# EAGLE design LoRa_Photon2 (EAGLE 9.6.2)

## Sheet 1 of 2

## Sheet 2 of 2
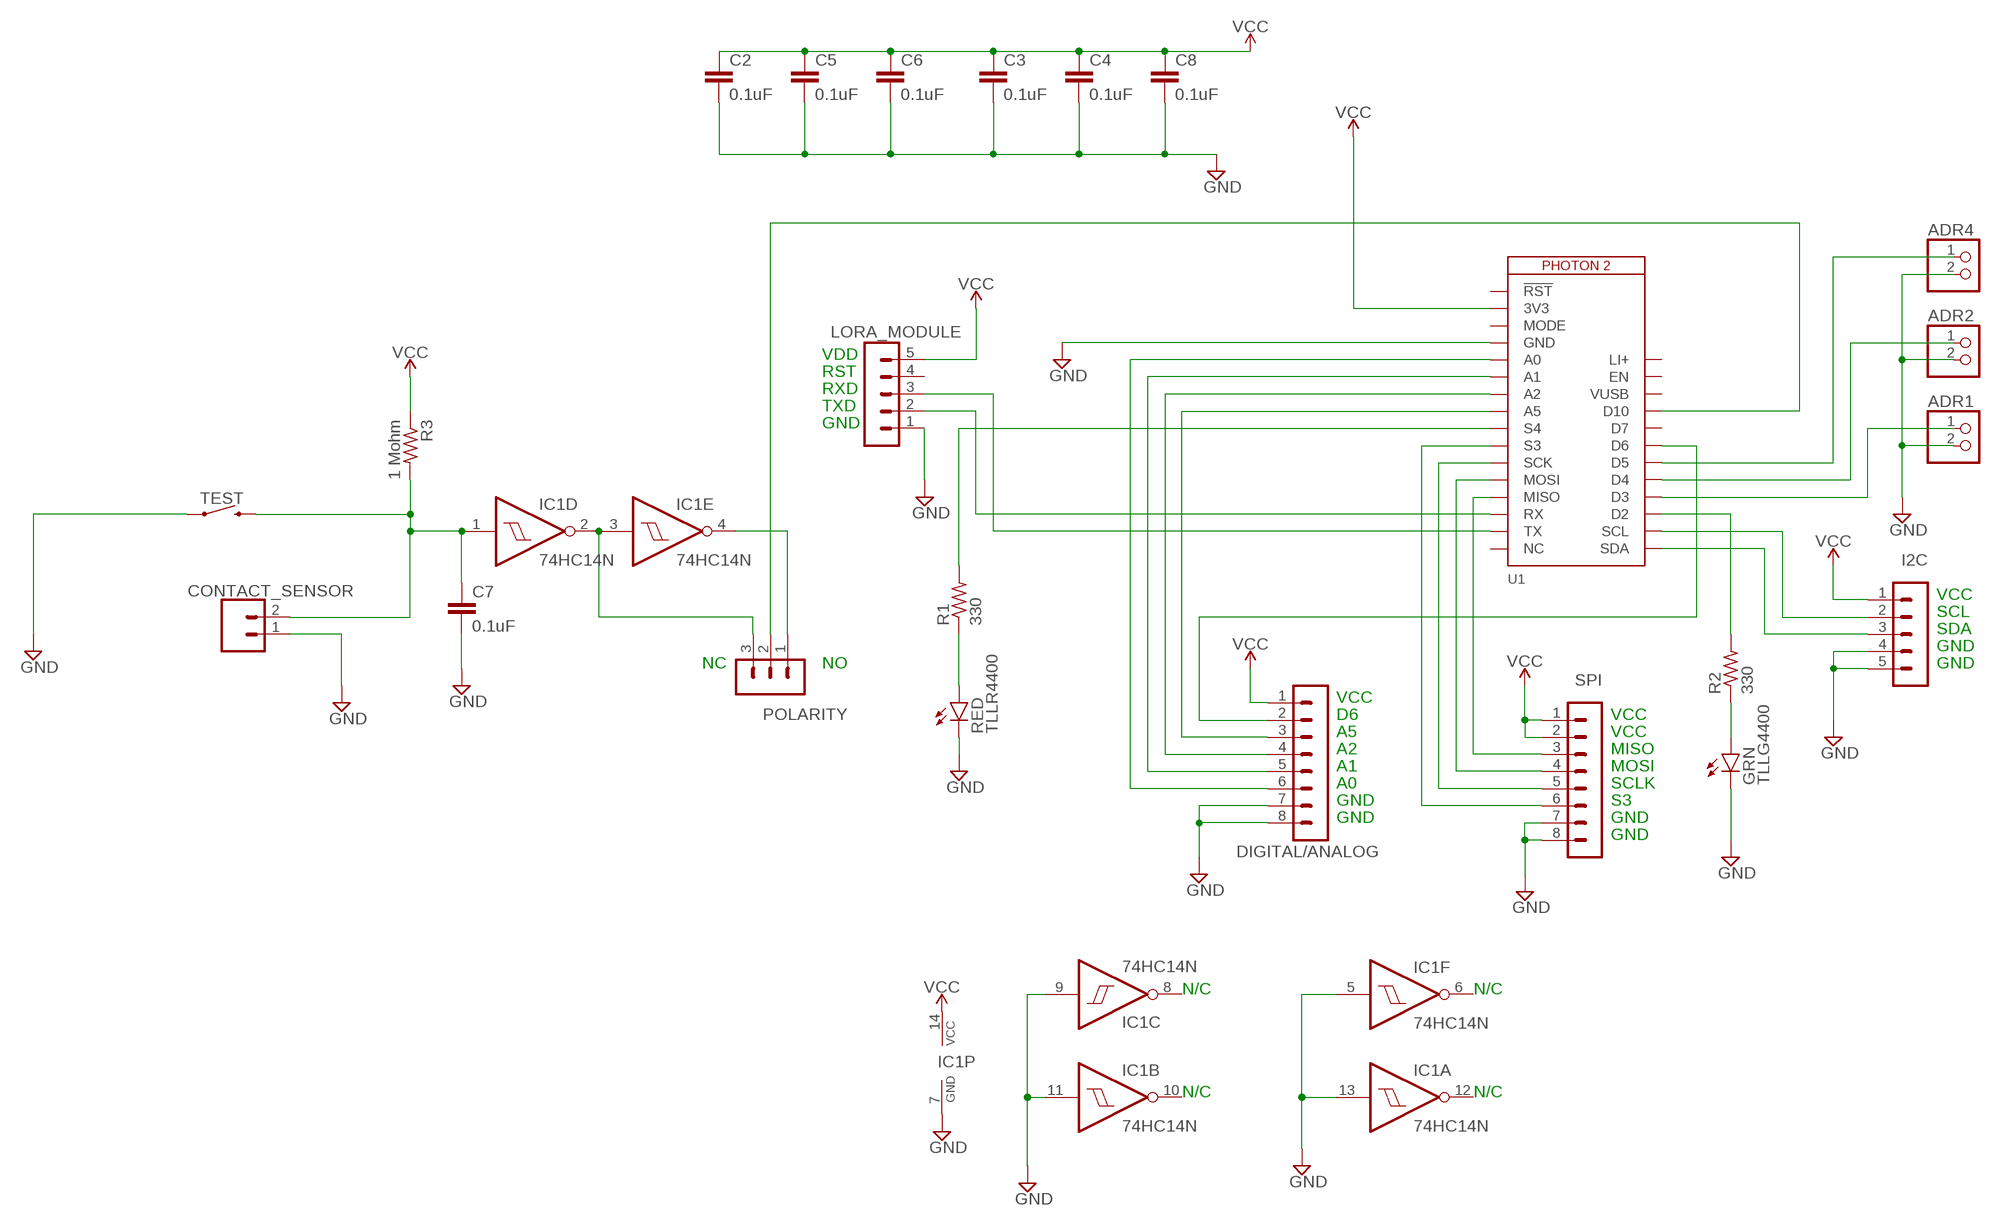
[diagram p0: schematic, sheet 2]

### Parts
ADR1  PINHD-1X2  [1X02]
ADR2  PINHD-1X2  [1X02]
ADR4  PINHD-1X2  [1X02]
C2  0.1uF  0.1UF-KIT-EZ-50V-20%  [CAP-PTH-SMALL-KIT]
C3  0.1uF  0.1UF-KIT-EZ-50V-20%  [CAP-PTH-SMALL-KIT]
C4  0.1uF  0.1UF-KIT-EZ-50V-20%  [CAP-PTH-SMALL-KIT]
C5  0.1uF  0.1UF-KIT-EZ-50V-20%  [CAP-PTH-SMALL-KIT]
C6  0.1uF  0.1UF-KIT-EZ-50V-20%  [CAP-PTH-SMALL-KIT]
C7  0.1uF  0.1UF-KIT-EZ-50V-20%  [CAP-PTH-SMALL-KIT]
C8  0.1uF  0.1UF-KIT-EZ-50V-20%  [CAP-PTH-SMALL-KIT]
CONTACT_SENSOR  CONN_023.5MM  [SCREWTERMINAL-3.5MM-2]
DIGITAL/ANALOG  MA08-1  [MA08-1]
GRN  TLLG4400  [LED3MM]
I2C  MA05-1  [MA05-1]
IC1  74HC14N  [DIL14]
LORA_MODULE  MA05-1  [MA05-1]
POLARITY  MA03-1  [MA03-1]
R1  330  R-US_0309/12  [0309/12]
R2  330  R-US_0309/12  [0309/12]
R3  1 Mohm  R-US_0309/12  [0309/12]
RED  TLLR4400  [LED3MM]
SPI  MA08-1  [MA08-1]
TEST  MOMENTARY-SWITCH-SPST-PTH-6.0MM  [TACTILE_SWITCH_PTH_6.0MM]
U1  PHOTON2  [PHOTON2]

### Nets
GND: ADR1.2 ADR2.2 ADR4.2 C2.2 C3.2 C4.2 C5.2 C6.2 C7.2 C8.2 CONTACT_SENSOR.1 DIGITAL/ANALOG.7 DIGITAL/ANALOG.8 GRN.K(C) I2C.4 I2C.5 IC1.5(F:I) IC1.7(P:GND) IC1.9(C:I) IC1.11(B:I) IC1.13(A:I) LORA_MODULE.1 RED.K(C) SPI.7 SPI.8 TEST.1 U1.4(GND)
N$1: C7.1 CONTACT_SENSOR.2 IC1.1(D:I) R3.2 TEST.3
N$2: LORA_MODULE.3 U1.15(TX)
N$3: GRN.A R2.1
N$4: R2.2 U1.19(D2)
N$5: R1.2 U1.9(S4)
N$6: R1.1 RED.A
N$7: ADR4.1 U1.22(D5)
N$8: IC1.2(D:O) IC1.3(E:I) POLARITY.3
N$9: IC1.4(E:O) POLARITY.1
N$10: I2C.2 U1.18(SCL)
N$11: ADR2.1 U1.21(D4)
N$12: LORA_MODULE.2 U1.14(RX)
N$13: I2C.3 U1.17(SDA)
N$14: POLARITY.2 U1.25(D10)
N$15: ADR1.1 U1.20(D3)
N$16: SPI.3 U1.13(MISO)
N$17: SPI.4 U1.12(MOSI)
N$18: SPI.5 U1.11(SCK)
N$19: SPI.6 U1.10(S3)
N$20: DIGITAL/ANALOG.2 U1.23(D6)
N$21: DIGITAL/ANALOG.3 U1.8(A5)
N$22: DIGITAL/ANALOG.4 U1.7(A2)
N$23: DIGITAL/ANALOG.5 U1.6(A1)
N$24: DIGITAL/ANALOG.6 U1.5(A0)
VCC: C2.1 C3.1 C4.1 C5.1 C6.1 C8.1 DIGITAL/ANALOG.1 I2C.1 IC1.14(P:VCC) LORA_MODULE.5 R3.1 SPI.1 SPI.2 U1.2(3V3)
Unconnected: IC1.6(F:O) IC1.8(C:O) IC1.10(B:O) IC1.12(A:O) LORA_MODULE.4 U1.1(!RST) U1.3(MODE) U1.16(NC) U1.24(D7) U1.27(EN)

### Notes on the sheet
- VDD
- RST
- RXD
- TXD
- GND
- VCC
- SCL
- SDA
- GND
- NC | NO | GND
- VCC
- D6 | VCC
- A5 | VCC
- A2 | MISO
- A1 | MOSI
- A0 | SCLK
- GND | S3
- GND | GND
- GND
- N/C | N/C
- N/C | N/C

## Power pins joined to a net without a drawn wire
LI+: U1.28(LI+)
VUSB: U1.26(VUSB)

## Library data of the parts
ADR1 ADR2 ADR4 = pinhead:PINHD-1X2: PIN HEADER
C2-C8 = SparkFun-Capacitors:0.1UF: 0.1µF ceramic capacitors A capacitor is a passive two-terminal electrical component used to store electrical energy temporarily in an electric field.; PROD_ID: CAP-08370
CONTACT_SENSOR = SparkFun-Connectors:CONN_02: Multi connection point. Often used as Generic Header-pin footprint for 0.1 inch spaced/style header connections On any of the 0.1 inch spaced packages, you can populate with these: Break Away Headers - Straight <https://www.sparkfun.com/products/116> (PRT-00116) Break Away Male Headers - Right Angle <https://www.sparkfun.com/products/553> (PRT-00553) Female Headers <https://www.sparkfun.com/products/115> (PRT-00115) Break Away Headers - Machine Pin <https://www.sparkfun.com/products/117> (PRT-00117) Break Away Female Headers - Swiss Machine Pin <https://www.sparkfun.com/products/743> (PRT-00743) For SCREWTERMINALS and SPRING TERMINALS visit here: Screw Terimnals on SparkFun.com <https://www.sparkfun.com/search/results?term=Screw+Terminals> (5mm/3.5mm/2.54mm spacing) This device is also useful as a general connection point to wire up your design to another part of your project. Our various solder wires solder well into these plated through hole pads. Hook-Up Wire - Assortment (Stranded, 22 AWG) <https://www.sparkfun.com/products/11375> (PRT-11375) Hook-Up Wire - Assortment (Solid Core, 22 AWG) <https://www.sparkfun.com/products/11367> (PRT-11367) View the entire wire category on our website here <https://www.sparkfun.com/categories/141> Special notes: Molex polarized connector foot print use with: PRT-08233 with associated crimp pins and housings. 2.54_SCREWTERM for use with PRT-10571. 3.5mm Screw Terminal footprints for PRT-08084 5mm Screw Terminal footprints for use with PRT-08432; PROD_ID: CONN-08399
DIGITAL/ANALOG SPI = con-lstb:MA08-1: PIN HEADER; OC_FARNELL: unknown; OC_NEWARK: unknown
GRN = led:TLLG4400: Low Current (2mA) LED 3 mm Tinted Diffused Package color GREEN Source: Data sheet <http://www.farnell.com/datasheets/391098.pdf>; MF: VISHAY SEMICONDUCTOR; OC_FARNELL: 1612435
I2C LORA_MODULE = con-lstb:MA05-1: PIN HEADER; OC_FARNELL: unknown; OC_NEWARK: unknown
IC1 = 74xx-eu:74*14: Hex schmitt trigger INVERTER
POLARITY = con-lstb:MA03-1: PIN HEADER; OC_FARNELL: unknown; OC_NEWARK: unknown
R1-R3 = adafruit:R-US_: RESISTOR, American symbol
RED = led:TLLR4400: Low Current (2mA) LED 3 mm Tinted Diffused Package color RED Source: Data sheet <http://www.farnell.com/datasheets/391100.pdf>; MF: VISHAY SEMICONDUCTOR; OC_FARNELL: 1612437
TEST = SparkFun-Switches:MOMENTARY-SWITCH-SPST: Momentary Switch (Pushbutton) - SPST Normally-open (NO) SPST momentary switches (buttons, pushbuttons). Variants PTH-12MM - 12mm square, through-hole Momentary Pushbutton Switch - 12mm Square <https://www.sparkfun.com/products/9190> (COM-09190) PTH-6.0MM, PTH-6.0MM-KIT - 6.0mm square, through-hole Mini Pushbutton Switch <https://www.sparkfun.com/products/97> (COM-00097) KIT package intended for soldering kit's - only one side of pads' copper is exposed. PTH-RIGHT-ANGLE-KIT - Right-angle, through-hole Right Angle Tactile Button <https://www.sparkfun.com/products/10791> - Used on SparkFun BigTime Watch Kit <https://www.sparkfun.com/products/11734> SMD-12MM - 12mm square, surface-mount Tactile Button - SMD (12mm) <https://www.sparkfun.com/products/12993> (COM-12993) Used on SparkFun PicoBoard <https://www.sparkfun.com/products/11888> SMD-4.5MM - 4.5mm Square Trackball Switch Used on SparkFun Blackberry Trackballer Breakout <https://www.sparkfun.com/products/13169> SMD-4.6MMX2.8MM - 4.60mm x 2.80mm, surface mount Used on SparkFun SAMD21 Mini Breakout <https://www.sparkfun.com/products/13664> SMD-5.2MM, SMD-5.2-REDUNDANT - 5.2mm square, surface-mount Mini Pushbutton Switch - SMD <https://www.sparkfun.com/products/8720> (COM-08720) Used on Arduino Pro Mini <https://www.sparkfun.com/products/11114> REDUNDANT package connects both switch circuits together SMD-6.0X3.5MM - 6.0 x 3.5mm, surface mount Momentary Reset Switch SMD <https://www.sparkfun.com/products/8229> (COM-08229) SMD-6.2MM-TALL - 6.2mm square, surface mount Tactile Button - SMD (6mm) <https://www.sparkfun.com/products/12992> Used on SparkFun Digital Sandbox <https://www.sparkfun.com/products/12651> SMD-RIGHT-ANGLE - Right-angle, surface mount Used on SparkFun Block for Intel® Edison - Arduino <https://www.sparkfun.com/products/13036>; PROD_ID: SWCH-08441; SF_SKU: COM-00097
U1 = Particle-Devices:PHOTON2: Particle Photon 2 Wi-Fi enabled development kit Footprint and formfactor based on Adafruit Feather. <https://www.adafruit.com/feather>

## Board
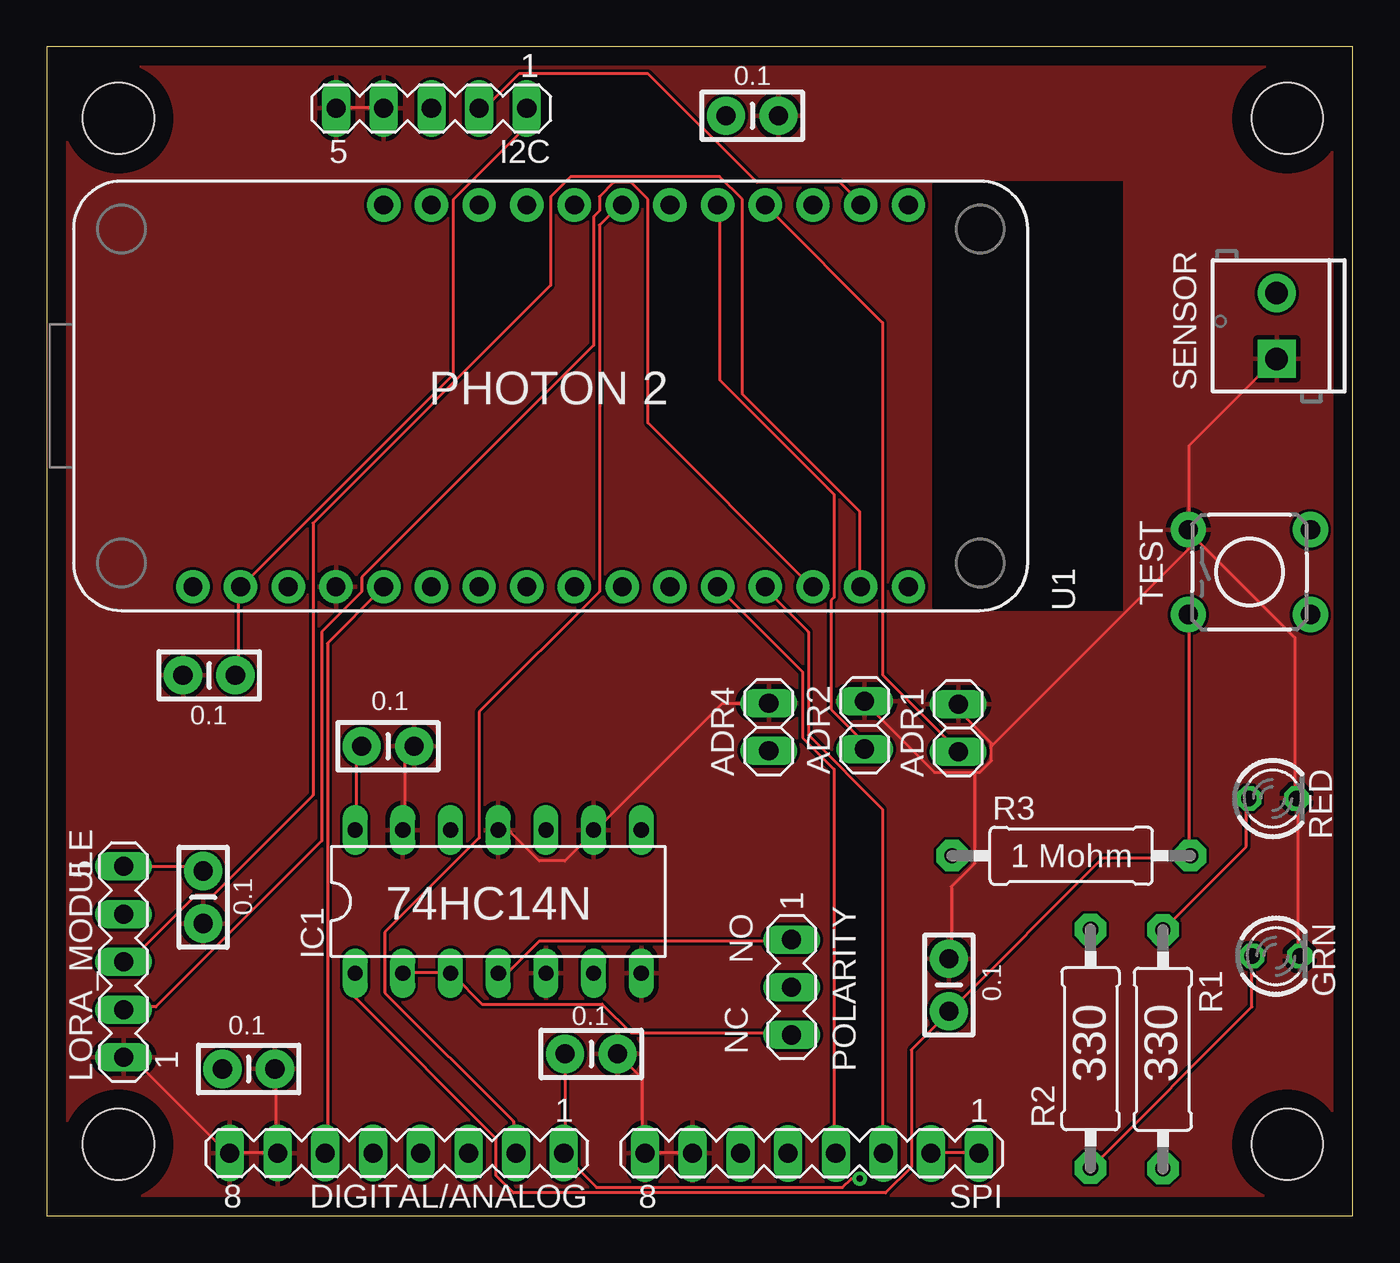
[diagram p1: board, top side]
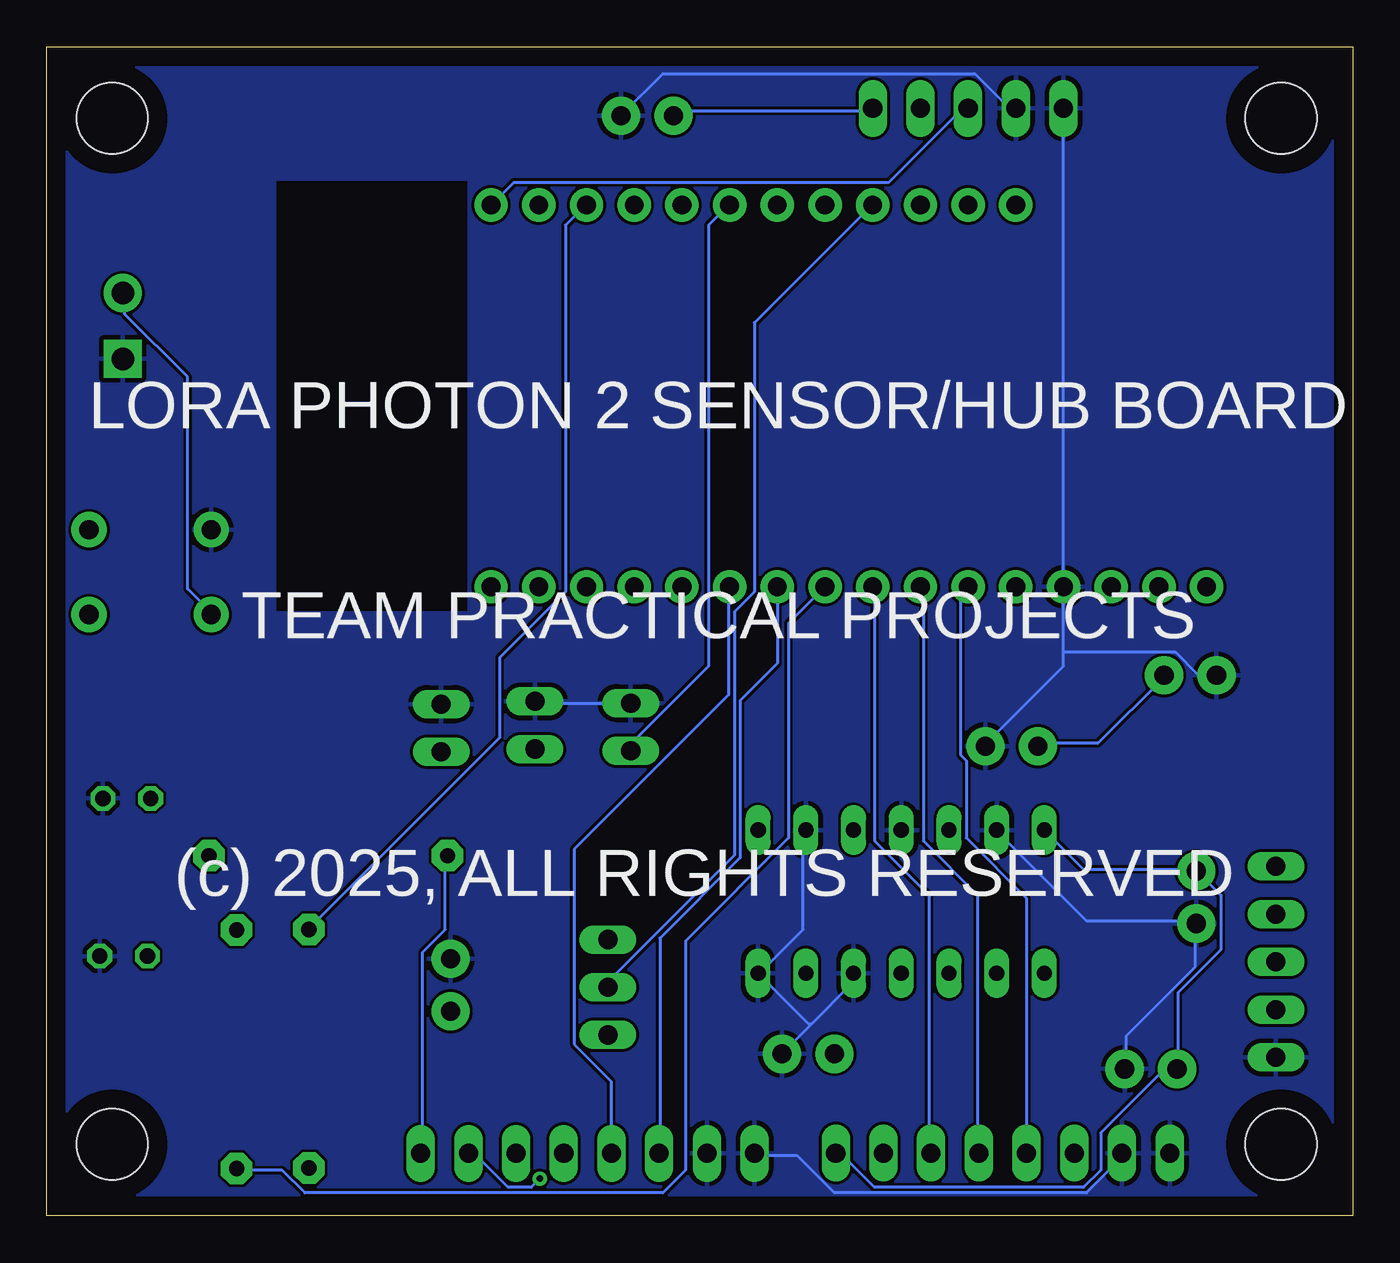
[diagram p2: board, bottom side, seen from below]

Size 69.52 x 62.22 mm. Coordinates in mm from the lower left corner, seen from the top.
Outline: 0,0 69.52,0 69.52,62.22 0,62.22 0,0
Copper layers (1*16): Top 0.035mm / dielectric 1.5mm / Bottom 0.035mm
Design rules "default": minimum track width 6mil, minimum drill 0.35mm, track to track 6mil, track to pad 6mil, pad to pad 6mil, via to via 6mil, smd to smd 6mil, copper to edge 40mil, drill to drill 6mil, minimum pad ring 10mil, minimum via ring 8mil, stop-mask expansion 4mil, vias tented up to drill 0mil, thermal gap 10mil
Holes 3.8 mm at 3.81,58.42 66.04,58.42 66.04,3.81 3.81,3.81
tKeepout: area 47,31.8 to 57.1,55.9
bKeepout: area 47,31.8 to 57.1,55.9

### Footprints (pad centres in the part's own frame; a part is rotated, then mirrored left to right if it is on the bottom)
1X02 = drill 1.016 long: 1 -1.27,0; 2 1.27,0
CAP-PTH-SMALL-KIT = drill 1.016 pad 2.032: 1 -1.397,0; 2 1.397,0
SCREWTERMINAL-3.5MM-2 = drill 1.2 pad 2.032 square: 1 0,0 | drill 1.2 pad 2.032: 2 3.5,0
MA08-1 = drill 1.016 long: 1 -8.89,0; 2 -6.35,0; 3 -3.81,0; 4 -1.27,0; 5 1.27,0; 6 3.81,0; 7 6.35,0; 8 8.89,0
LED3MM = drill 0.813 octagon: A -1.27,0; K 1.27,0
MA05-1 = drill 1.016 long: 1 -5.08,0; 2 -2.54,0; 3 0,0; 4 2.54,0; 5 5.08,0
DIL14 = drill 0.813 long: 1 -7.62,-3.81; 2 -5.08,-3.81; 3 -2.54,-3.81; 4 0,-3.81; 5 2.54,-3.81; 6 5.08,-3.81; 7 7.62,-3.81; 8 7.62,3.81; 9 5.08,3.81; 10 2.54,3.81; 11 0,3.81; 12 -2.54,3.81; 13 -5.08,3.81; 14 -7.62,3.81
MA03-1 = drill 1.016 long: 1 -2.54,0; 2 0,0; 3 2.54,0
0309/12 = drill 0.813 pad 1.676 octagon: 1 -6.35,0; 2 6.35,0
TACTILE_SWITCH_PTH_6.0MM = drill 1.016 pad 1.88: 1 -3.251,2.261; 2 3.251,2.261; 3 -3.251,-2.261; 4 3.251,-2.261
PHOTON2 = drill 1 pad 1.778: 1 1.27,44.45; 2 1.27,41.91; 3 1.27,39.37; 4 1.27,36.83; 5 1.27,34.29; 6 1.27,31.75; 7 1.27,29.21; 8 1.27,26.67; 9 1.27,24.13; 10 1.27,21.59; 11 1.27,19.05; 12 1.27,16.51; 13 1.27,13.97; 14 1.27,11.43; 15 1.27,8.89; 16 1.27,6.35; 17 21.59,6.35; 18 21.59,8.89; 19 21.59,11.43; 20 21.59,13.97; 21 21.59,16.51; 22 21.59,19.05; 23 21.59,21.59; 24 21.59,24.13; 25 21.59,26.67; 26 21.59,29.21; 27 21.59,31.75; 28 21.59,34.29

### Placement (x,y rotation side)
ADR1  48.52,25.97 90 top
ADR2  43.54,26.12 90 top
ADR4  38.43,26.02 90 top
C2  8.32,16.96 270 top
C3  18.16,25 0 top
C4  8.64,28.77 180 top
C5  10.74,7.82 0 top
C6  28.99,8.62 0 top
C7  48.03,12.29 90 top
C8  37.56,58.56 0 top
CONTACT_SENSOR  65.48,45.62 90 top
DIGITAL/ANALOG  18.63,3.34 180 top
GRN  65.44,13.83 0 top
I2C  20.47,58.95 180 top
IC1  24.03,16.73 0 top
LORA_MODULE  4.08,13.52 90 top
POLARITY  39.65,12.17 270 top
R1  59.42,8.87 270 top
R2  55.57,8.9 90 top
R3  54.54,19.17 0 top
RED  65.27,22.22 0 top
SPI  40.73,3.33 180 top
TEST  64.03,34.27 0 top
U1  52.22,32.22 90 top

### Tracks (layer width: path | path; a pad name or v marks a point on that pad's centre or on a via)
GND
  Top 0.152: GRN.K 66.6,13.87 66.6,22.1 RED.K 66.45,22.25 66.45,30.79 61.27,35.97 | TEST.1 60.81,36.58 60.81,41 65.38,45.57 CONTACT_SENSOR.1 | 61.27,35.97 60.81,36.42 TEST.1 | 50.29,24.99 50.29,24.23 49.68,23.62 49.38,23.62 | 50.29,24.99 50.29,25.15 48.62,26.82 48.62,27.13 ADR1.2 | 49.38,23.62 47.24,23.62 43.59,27.28 ADR2.2 | 49.38,23.62 49.38,18.75 48.16,17.53 48.16,13.72 C7.2 | IC1.11 24.08,20.42 24.69,20.42 26.21,18.9 27.58,18.9 29.11,20.42 IC1.9 29.26,20.57 35.97,27.28 38.41,27.28 ADR4.2 | SPI.7 34.29,3.35 31.85,3.35 SPI.8 31.7,3.35 31.7,7.32 30.48,8.53 C6.2 | 50.29,24.99 61.27,35.97 | 61.27,35.97 TEST.1 | I2C.5 15.39,58.98 17.83,58.98 I2C.4 | 12.19,3.35 9.75,3.35 DIGITAL/ANALOG.8 9.6,3.35 4.57,8.38 4.12,8.38 LORA_MODULE.1 | 12.19,3.35 12.19,7.77 C5.2 | 12.19,3.35 DIGITAL/ANALOG.7 | IC1.13 19.05,20.57 19.05,24.54 19.51,24.99 C3.2
  Bottom 0.152: ADR4.2 38.56,27.28 43.43,27.28 ADR2.2 | 28.8,10.21 30.33,8.69 C6.2 | 28.8,10.21 26.67,12.34 26.67,12.8 IC1.5 | 28.8,10.21 28.96,10.21 31.55,12.8 IC1.7 31.55,12.95 29.26,15.24 29.26,20.42 IC1.9 | I2C.4 17.98,58.98 18.29,58.98 20.12,60.81 36.73,60.81 38.86,58.67 C8.2 | C5.2 12.04,7.92 12.04,9.6 8.38,13.26 8.38,15.54 C2.2 8.38,15.7 14.17,15.7 18.9,20.42 IC1.13 | 15.39,30.02 15.39,29.26 19.51,25.15 C3.2 | 15.39,30.02 15.39,33.38 U1.4 15.39,33.53 15.39,58.83 I2C.5 | 15.39,30.02 9.45,30.02 8.23,28.8 7.32,28.8 C4.2 | SPI.8 31.7,3.2 29.57,3.2 27.58,1.22 14.17,1.22 12.19,3.2 DIGITAL/ANALOG.7
  pour Top: 0,0 69.85,0 69.85,62.23 0,62.23
  pour Bottom: 0,0 69.85,0 69.85,62.23 0,62.23
N$1
  Top 0.152: TEST.3 60.81,32 60.81,19.2 R3.2 60.81,19.05 56.24,19.05 48.16,10.97 C7.1 48.01,10.82 46.02,8.84 46.02,2.59 44.65,1.22 24.84,1.22 23.93,2.13 23.93,4.12 16.46,11.58 16.46,12.8 IC1.1
  Bottom 0.152: CONTACT_SENSOR.2 65.38,49.07 65.38,48.01 62.03,44.65 62.03,33.38 60.81,32.16 TEST.3
N$2
  Top 0.152: LORA_MODULE.3 4.12,13.56 4.42,13.56 7.92,17.07 8.84,17.07 14.17,22.4 14.17,36.88 26.82,49.53 26.82,54.25 27.89,55.32 35.81,55.32 37.03,54.1 37.03,43.74 43.28,37.49 43.28,33.53 U1.15
N$3
  Top 0.152: GRN.A 64.16,13.72 64.16,11.12 55.63,2.59 R2.1
N$4
  Bottom 0.152: R2.2 55.47,15.39 45.41,25.45 45.41,29.72 41.91,33.22 41.91,52.73 40.84,53.8 U1.19
N$5
  Bottom 0.152: R1.2 59.28,2.44 57,2.44 55.78,1.22 36.73,1.22 35.51,2.44 35.51,14.63 30.02,20.12 30.02,31.55 28.19,33.38 U1.9
N$6
  Top 0.152: RED.A 63.86,22.1 63.86,19.66 59.44,15.24 R1.1
N$7
  Bottom 0.152: ADR4.1 38.41,24.84 38.41,25.15 34.29,29.26 34.29,52.73 33.22,53.8 U1.22
N$8
  Top 0.152: IC1.2 19.05,12.95 21.49,12.95 IC1.3 21.64,12.8 23.16,11.28 29.57,11.28 31.09,9.75 39.62,9.75 POLARITY.3
N$9
  Top 0.152: IC1.4 24.08,12.95 24.54,12.95 26.21,14.63 39.62,14.63 POLARITY.1
N$10
  Top 0.152: I2C.2 23.01,58.98 23.32,58.98 25.15,60.81 32,60.81 37.8,55.02 42.22,55.02 43.28,53.95 U1.18
N$11
  Top 0.152: ADR2.1 43.43,24.99 43.43,25.3 41.76,26.98 41.76,32.77 41.91,32.92 41.91,38.41 35.81,44.5 35.81,53.8 U1.21
N$12
  Top 0.152: LORA_MODULE.2 4.12,11.12 5.79,11.12 14.63,19.96 14.63,31.09 16.76,33.22 16.76,33.98 29.11,46.33 29.11,53.19 29.41,53.49 29.41,54.25 30.18,55.02 31.09,55.02 32,54.1 32,42.22 40.69,33.53 U1.14
N$13
  Bottom 0.152: I2C.3 20.57,58.83 20.88,58.83 24.69,55.02 44.65,55.02 45.72,53.95 U1.17
N$14
  Bottom 0.152: POLARITY.2 39.62,12.19 39.62,12.5 32.92,19.2 32.92,32.16 31.85,33.22 31.85,47.55 25.6,53.8 U1.25
N$15
  Top 0.152: ADR1.1 48.46,24.84 44.5,28.8 44.5,47.55 38.25,53.8 U1.20
N$16
  Top 0.152: SPI.3 44.5,3.35 44.5,21.64 40.54,25.6 40.54,31.09 38.25,33.38 U1.13
N$17
  Top 0.152: SPI.4 41.91,3.35 41.91,23.77 40.23,25.45 40.23,28.96 35.81,33.38 U1.12
N$18
  Bottom 0.152: SPI.5 39.47,3.35 39.47,7.16 41.45,9.14 41.45,19.51 33.22,27.74 33.22,33.38 U1.11
N$19
  Bottom 0.152: SPI.6 36.88,3.35 36.88,14.78 32.61,19.05 32.61,27.43 30.63,29.41 30.63,33.38 U1.10
N$20
  Top 0.152: DIGITAL/ANALOG.2 24.84,3.35 24.84,5.03 17.98,11.89 17.98,15.09 23.01,20.12 23.01,26.82 29.41,33.22 29.41,52.73 30.48,53.8 U1.23
N$21
  Bottom 0.152: DIGITAL/ANALOG.3 22.55,3.35 22.55,17.07 25.45,19.96 25.45,33.38 U1.8
N$22
  Bottom 0.152: DIGITAL/ANALOG.4 19.96,3.35 19.96,17.07 22.86,19.96 22.86,33.38 U1.7
N$23
  Bottom 0.152: DIGITAL/ANALOG.5 17.37,3.35 17.37,16.92 20.57,20.12 20.57,24.23 20.88,24.54 20.88,33.07 20.57,33.38 U1.6
N$24
  Top 0.152: DIGITAL/ANALOG.6 14.94,3.35 14.94,30.48 17.83,33.38 U1.5
VCC  (via drill 0.35)
  Top 0.152: SPI.2 47.09,3.35 49.53,3.35 SPI.1 | C6.1 27.58,8.53 27.58,3.35 DIGITAL/ANALOG.1 27.58,3.2 29.26,1.52 42.37,1.52 42.82,1.98 v43.28,1.98 | LORA_MODULE.5 4.12,18.59 8.08,18.59 8.23,18.44 C2.1 | IC1.14 16.46,20.57 16.46,24.84 16.61,24.99 C3.1 | C4.1 10.06,28.8 10.21,28.96 10.21,33.38 U1.2 10.36,33.53 21.64,44.81 21.64,54.1 25.45,57.91 25.45,58.83 I2C.1
  Bottom 0.152: R3.1 48.31,19.05 48.31,15.24 49.53,14.02 49.53,3.35 SPI.1 | DIGITAL/ANALOG.1 27.43,3.2 27.13,3.2 25.45,1.52 14.33,1.52 13.41,2.44 13.41,4.42 10.06,7.77 9.45,7.77 C5.1 9.3,7.92 9.3,11.89 7.01,14.17 7.01,17.07 8.23,18.29 C2.1 8.38,18.44 14.33,18.44 16.31,20.42 IC1.14 | v43.28,1.98 43.74,1.52 44.96,1.52 46.63,3.2 46.94,3.2 SPI.2 | I2C.1 25.6,58.83 35.97,58.83 36.12,58.67 C8.1 | C3.1 16.61,25.15 13.56,25.15 10.06,28.65 C4.1

### Text on the board
tPlace: 0.1 | SENSOR | PHOTON 2 | TEST | 0.1 | 0.1 | 1 Mohm | 0.1 | 74HC14N | NO | 0.1 | 0.1 | 0.1 | NC | 330 | 330
bPlace: LORA PHOTON 2 SENSOR/HUB BOARD | TEAM PRACTICAL PROJECTS | (c) 2025, ALL RIGHTS RESERVED